# EAGLE design fpga-shield-v1.0 (EAGLE 7.5.0)
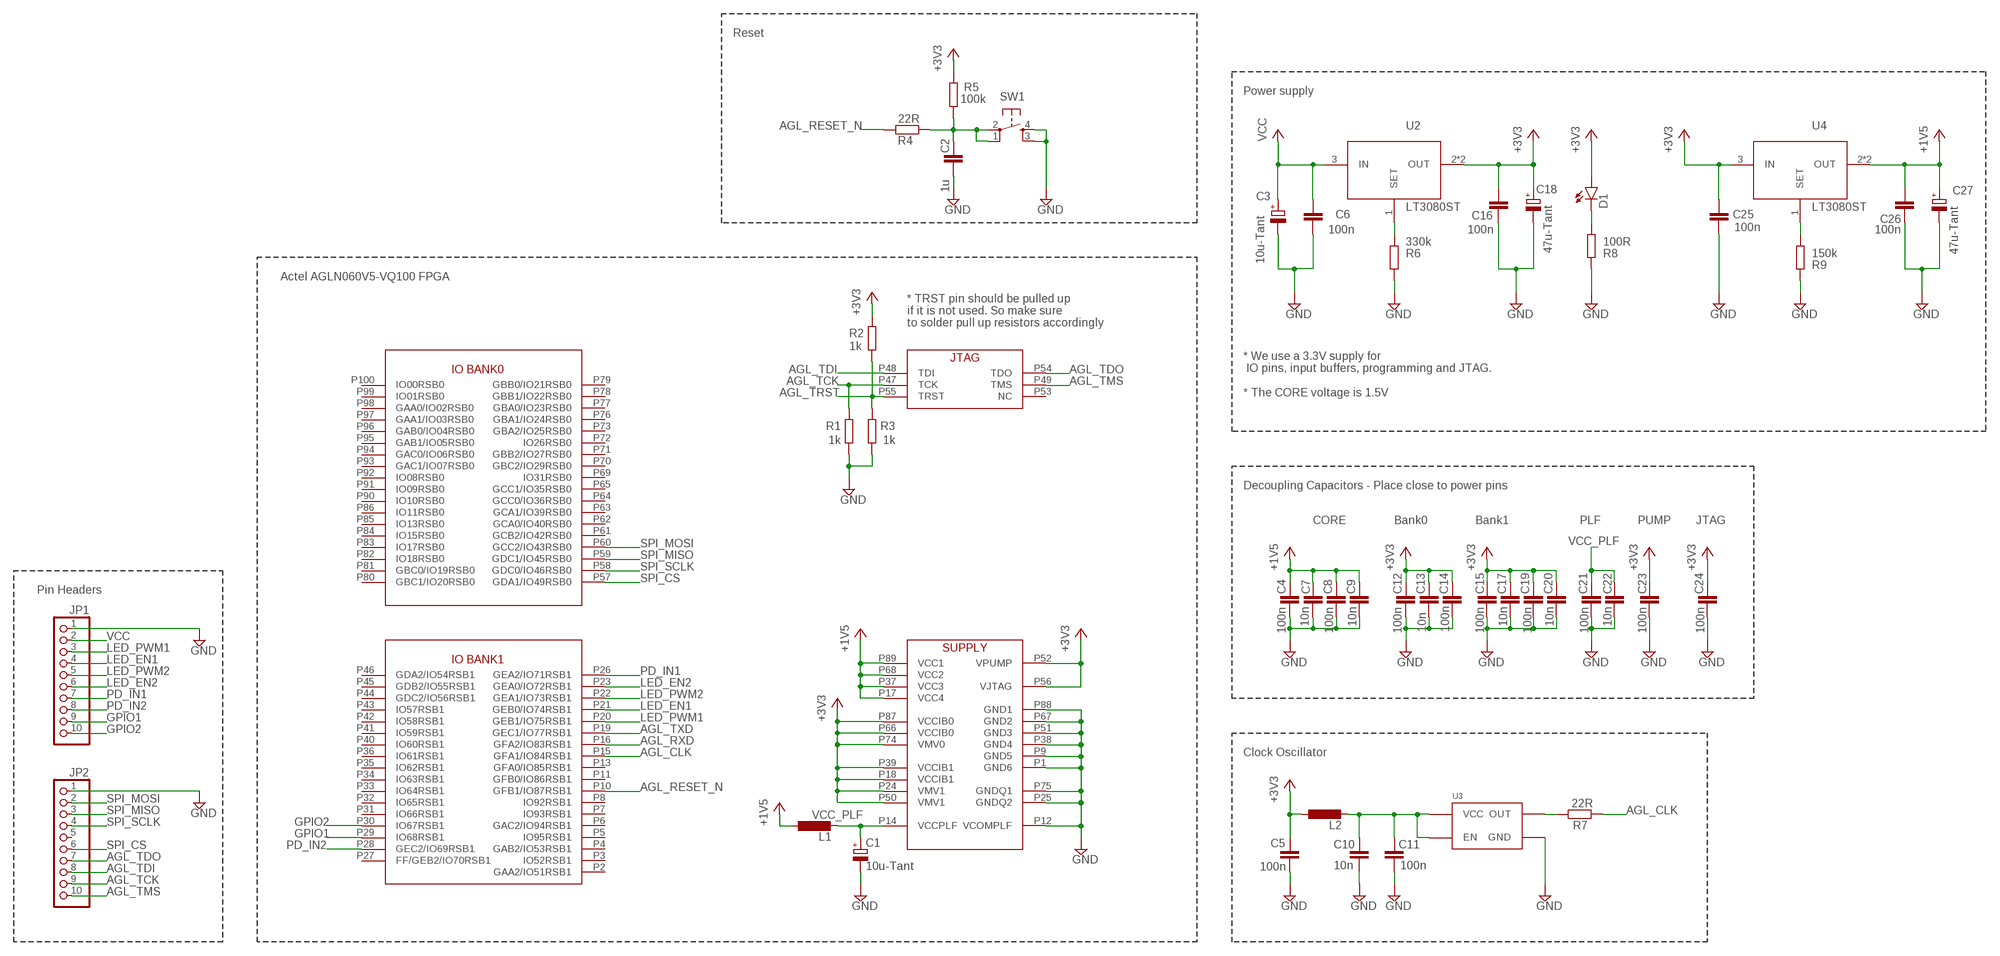
[diagram p0: schematic, sheet 1]

## Parts
C1  10u-Tant  CPOL-EUCT3528  [CT3528]
C2  1u  C-EUC0805  [C0805]
C3  10u-Tant  CPOL-EUCT3528  [CT3528]
C4  100n  C-EUC0805  [C0805]
C5  100n  C-EUC0805  [C0805]
C6  100n  C-EUC0805  [C0805]
C7  10n  C-EUC0805  [C0805]
C8  100n  C-EUC0805  [C0805]
C9  10n  C-EUC0805  [C0805]
C10  10n  C-EUC0805  [C0805]
C11  100n  C-EUC0805  [C0805]
C12  100n  C-EUC0805  [C0805]
C13  10n  C-EUC0805  [C0805]
C14  100n  C-EUC0805  [C0805]
C15  100n  C-EUC0805  [C0805]
C16  100n  C-EUC0805  [C0805]
C17  10n  C-EUC0805  [C0805]
C18  47u-Tant  CPOL-EUCT3528  [CT3528]
C19  100n  C-EUC0805  [C0805]
C20  10n  C-EUC0805  [C0805]
C21  100n  C-EUC0805  [C0805]
C22  10n  C-EUC0805  [C0805]
C23  100n  C-EUC0805  [C0805]
C24  100n  C-EUC0805  [C0805]
C25  100n  C-EUC0805  [C0805]
C26  100n  C-EUC0805  [C0805]
C27  47u-Tant  CPOL-EUCT3528  [CT3528]
D1  LED0603  [LED-0603]
JP1  PINHD-1X10  [1X10]
JP2  PINHD-1X10  [1X10]
L1  L-EUL3216C  [L3216C]
L2  L-EUL3216C  [L3216C]
R1  1k  R-EU_R0805  [R0805]
R2  1k  R-EU_R0805  [R0805]
R3  1k  R-EU_R0805  [R0805]
R4  22R  R-EU_R0805  [R0805]
R5  100k  R-EU_R0805  [R0805]
R6  330k  R-EU_R0805  [R0805]
R7  22R  R-EU_R0805  [R0805]
R8  100R  R-EU_R0805  [R0805]
R9  150k  R-EU_R0805  [R0805]
SW1  10-XX4X4SMD  [BT4X4]
U1  AGLN060VQ100  [VQ100]
U2  LT3080ST  [SOT223]
U3  ASFL1  [ASFL1]
U4  LT3080ST  [SOT223]

## Nets
+1V5: C4.1 C7.1 C8.1 C9.1 C26.1 C27.+ L1.1 U1.P17(VCC4) U1.P37(VCC3) U1.P68(VCC2) U1.P89(VCC1) U4.2(OUT) U4.4(OUT)
+3V3: C5.1 C12.1 C13.1 C14.1 C15.1 C16.1 C17.1 C18.+ C19.1 C20.1 C23.1 C24.1 C25.1 D1.A L2.1 R2.2 R5.2 U1.P18(VCCIB1) U1.P24(VMV1) U1.P39(VCCIB1) U1.P50(VMV1) U1.P52(VPUMP) U1.P56(VJTAG) U1.P66(VCCIB0) U1.P74(VMV0) U1.P87(VCCIB0) U2.2(OUT) U2.4(OUT) U4.3(IN)
AGL_CLK: R7.2 U1.P15(GFA1/IO84RSB1)
AGL_RESET_N: R4.2 U1.P10(GFB1/IO87RSB1)
AGL_RXD: U1.P16(GFA2/IO83RSB1)
AGL_TCK: JP2.9 R1.2 U1.P47(TCK)
AGL_TDI: JP2.8 U1.P48(TDI)
AGL_TDO: JP2.7 U1.P54(TDO)
AGL_TMS: JP2.10 U1.P49(TMS)
AGL_TRST: R2.1 R3.2 U1.P55(TRST)
AGL_TXD: U1.P19(GEC1/IO77RSB1)
GND: C1.- C2.2 C3.- C4.2 C5.2 C6.2 C7.2 C8.2 C9.2 C10.2 C11.2 C12.2 C13.2 C14.2 C15.2 C16.2 C17.2 C18.- C19.2 C20.2 C21.2 C22.2 C23.2 C24.2 C25.2 C26.2 C27.- JP1.1 JP2.1 R1.1 R3.1 R6.2 R8.2 R9.2 SW1.3(S1) SW1.4(S) U1.P1(GND6) U1.P9(GND5) U1.P12(VCOMPLF) U1.P25(GNDQ2) U1.P38(GND4) U1.P51(GND3) U1.P67(GND2) U1.P75(GNDQ1) U1.P88(GND1) U3.P$2(GND)
GPIO1: JP1.9 U1.P29(IO68RSB1)
GPIO2: JP1.10 U1.P30(IO67RSB1)
LED_EN1: JP1.4 U1.P21(GEB0/IO74RSB1)
LED_EN2: JP1.6 U1.P23(GEA0/IO72RSB1)
LED_PWM1: JP1.3 U1.P20(GEB1/IO75RSB1)
LED_PWM2: JP1.5 U1.P22(GEA1/IO73RSB1)
N$1: R7.1 U3.P$3(OUT)
N$2: C10.1 C11.1 L2.2 U3.P$1(EN) U3.P$4(VCC)
N$3: D1.C R8.1
N$4: R6.1 U2.1(SET)
N$6: R9.1 U4.1(SET)
N$7: C2.1 R4.1 R5.1 SW1.1 SW1.2(P)
PD_IN1: JP1.7 U1.P26(GEA2/IO71RSB1)
PD_IN2: JP1.8 U1.P28(GEC2/IO69RSB1)
SPI_CS: JP2.6 U1.P57(GDA1/IO49RSB0)
SPI_MISO: JP2.3 U1.P59(GDC1/IO45RSB0)
SPI_MOSI: JP2.2 U1.P60(GCC2/IO43RSB0)
SPI_SCLK: JP2.4 U1.P58(GDC0/IO46RSB0)
VCC: C3.+ C6.1 JP1.2 U2.3(IN)
VCC_PLF: C1.+ C21.1 C22.1 L1.2 U1.P14(VCCPLF)
Unconnected: JP2.5 U1.P2(GAA2/IO51RSB1) U1.P3(IO52RSB1) U1.P4(GAB2/IO53RSB1) U1.P5(IO95RSB1) U1.P6(GAC2/IO94RSB1) U1.P7(IO93RSB1) U1.P8(IO92RSB1) U1.P11(GFB0/IO86RSB1) U1.P13(GFA0/IO85RSB1) U1.P27(FF/GEB2/IO70RSB1) U1.P31(IO66RSB1) U1.P32(IO65RSB1) U1.P33(IO64RSB1) U1.P34(IO63RSB1) U1.P35(IO62RSB1) U1.P36(IO61RSB1) U1.P40(IO60RSB1) U1.P41(IO59RSB1) U1.P42(IO58RSB1) U1.P43(IO57RSB1) U1.P44(GDC2/IO56RSB1) U1.P45(GDB2/IO55RSB1) U1.P46(GDA2/IO54RSB1) U1.P53(NC) U1.P61(GCB2/IO42RSB0) U1.P62(GCA0/IO40RSB0) U1.P63(GCA1/IO39RSB0) U1.P64(GCC0/IO36RSB0) U1.P65(GCC1/IO35RSB0) U1.P69(IO31RSB0) U1.P70(GBC2/IO29RSB0) U1.P71(GBB2/IO27RSB0) U1.P72(IO26RSB0) U1.P73(GBA2/IO25RSB0) U1.P76(GBA1/IO24RSB0) U1.P77(GBA0/IO23RSB0) U1.P78(GBB1/IO22RSB0) U1.P79(GBB0/IO21RSB0) U1.P80(GBC1/IO20RSB0) U1.P81(GBC0/IO19RSB0) U1.P82(IO18RSB0) U1.P83(IO17RSB0) U1.P84(IO15RSB0) U1.P85(IO13RSB0) U1.P86(IO11RSB0) U1.P90(IO10RSB0) U1.P91(IO09RSB0) U1.P92(IO08RSB0) U1.P93(GAC1/IO07RSB0) U1.P94(GAC0/IO06RSB0) U1.P95(GAB1/IO05RSB0) U1.P96(GAB0/IO04RSB0) U1.P97(GAA1/IO03RSB0) U1.P98(GAA0/IO02RSB0) U1.P99(IO01RSB0) U1.P100(IO00RSB0)

## Notes on the sheet
- Reset
- Power supply
- Actel AGLN060V5-VQ100 FPGA
- * TRST pin should be pulled up
  if it is not used. So make sure 
  to solder pull up resistors accordingly
- * We use a 3.3V supply for 
   IO pins, input buffers, programming and JTAG.
  
  * The CORE voltage is 1.5V
- Decoupling Capacitors - Place close to power pins
- CORE | Bank0 | Bank1 | PLF | PUMP | JTAG
- Pin Headers
- Clock Oscillator

## Library data of the parts
C1 C3 C18 C27 = rcl:CPOL-EU: POLARIZED CAPACITOR, European symbol
C2 C4-C17 C19-C26 = rcl:C-EU: CAPACITOR, European symbol
D1 = misc-parts:LED: LEDs Standard schematic elements and footprints for 5mm, 3mm, 1206, and 0603 sized LEDs. 5mm - Spark Fun Electronics SKU : COM-00529 (and others)
JP1 JP2 = pinhead:PINHD-1X10: PIN HEADER
L1 L2 = resistor:L-EU: INDUCTOR, European symbol
R1-R9 = resistor:R-EU_: RESISTOR, European symbol
SW1 = buttons:10-XX: OMRON SWITCH
U1 = igloo-nano:AGLN060
U2 U4 = misc-parts:LT3080
U3 = misc-parts:ASFL1

## Board
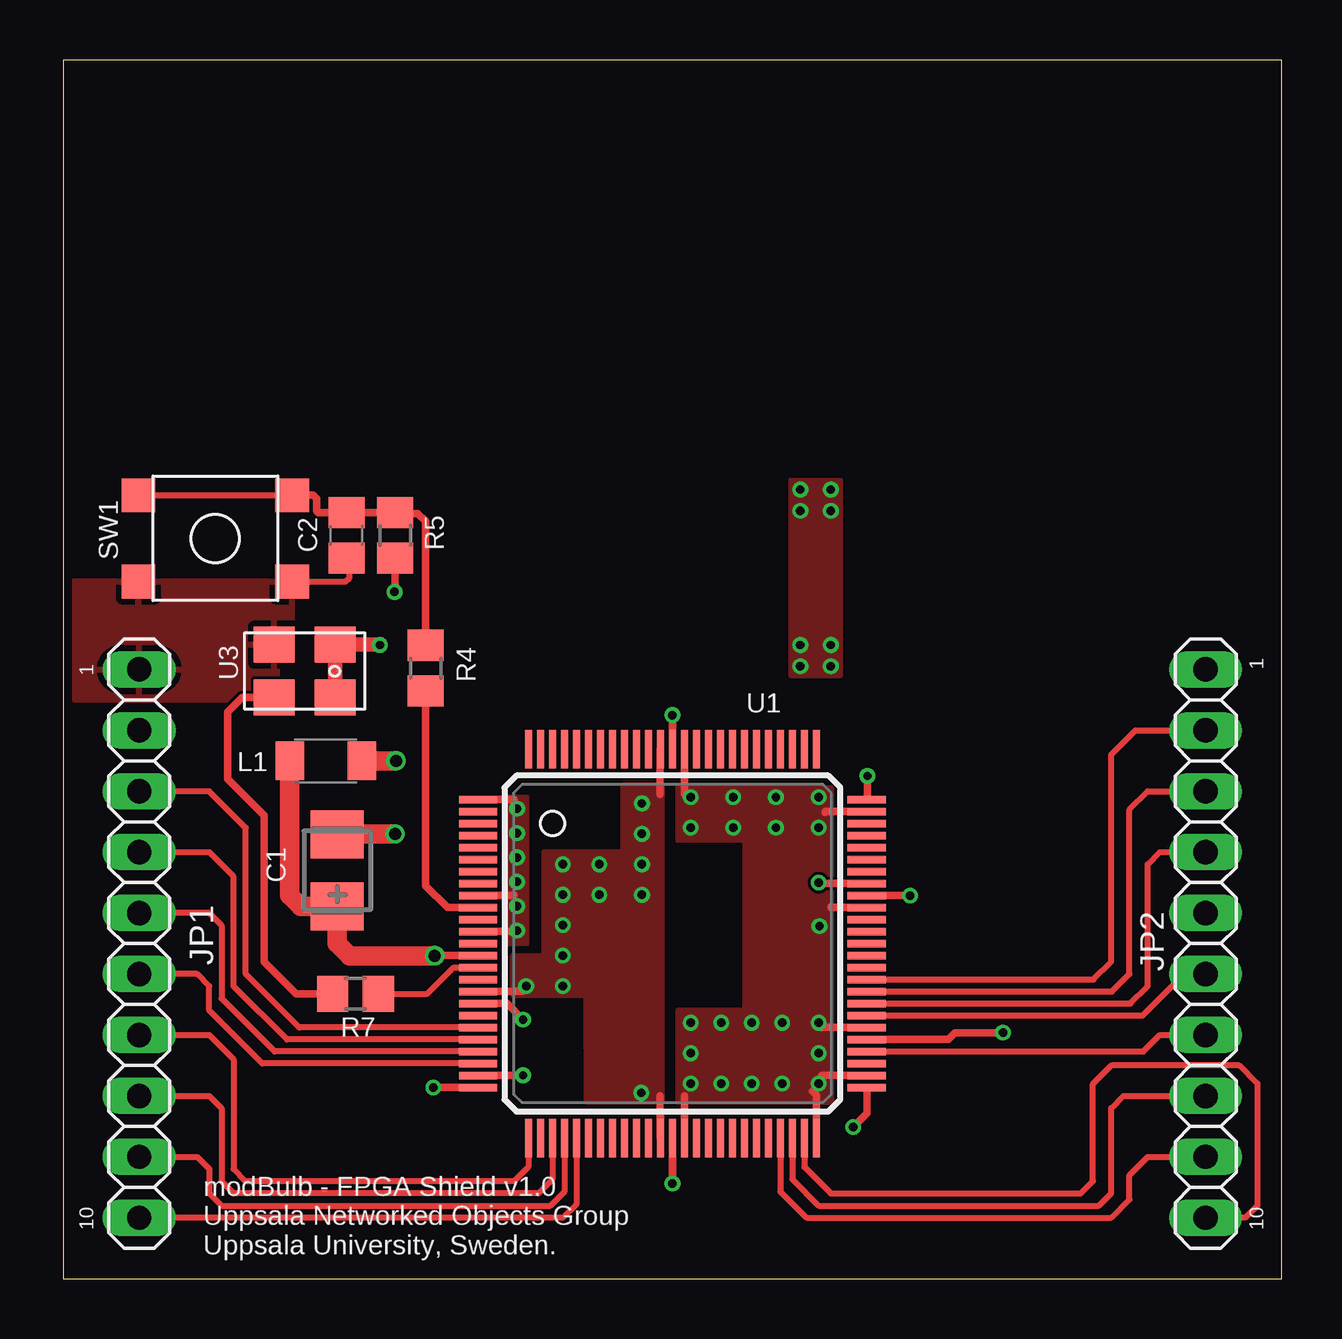
[diagram p1: board, top side]
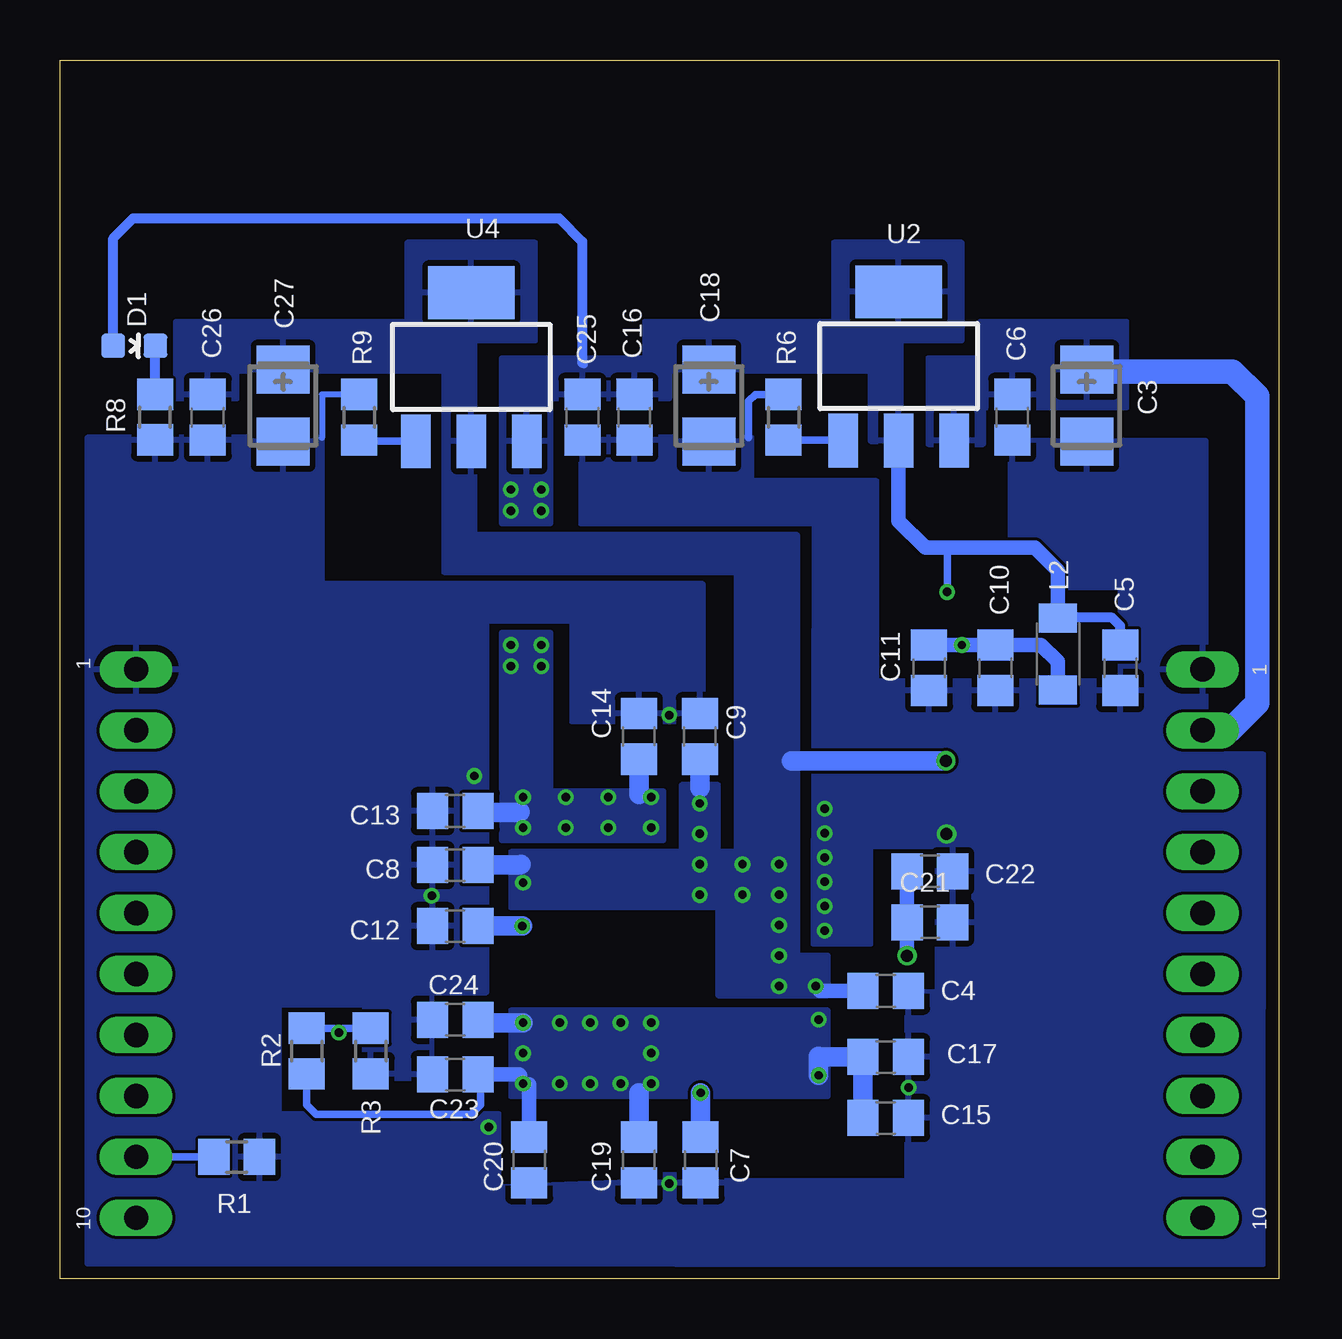
[diagram p2: board, bottom side, seen from below]

Size 50.8 x 50.8 mm. Coordinates in mm from the lower left corner, seen from the top.
Outline: 0,0 50.8,0 50.8,50.8 0,50.8 0,0
Copper layers (1*16): Top 0.035mm / dielectric 1.5mm / Bottom 0.035mm
Design rules "dirt_cheap_dirty_boards.v1": minimum track width 5mil, minimum drill 12mil, track to track 5mil, track to pad 5mil, pad to pad 5mil, via to via 5mil, smd to smd 0mil, copper to edge 10mil, drill to drill 10mil, minimum pad ring 10mil, minimum via ring 6mil, stop-mask expansion 2mil, vias tented up to drill 25mil, thermal gap 10mil

### Footprints (pad centres in the part's own frame; a part is rotated, then mirrored left to right if it is on the bottom)
CT3528 = smd 2 x 2.2: + -1.5,0; - 1.5,0
C0805 = smd 1.3 x 1.5: 1 -0.95,0; 2 0.95,0
LED-0603 = smd 1 x 1: A 0,-0.877; C 0,0.877
1X10 = drill 1.016 long: 1 -11.43,0; 2 -8.89,0; 3 -6.35,0; 4 -3.81,0; 5 -1.27,0; 6 1.27,0; 7 3.81,0; 8 6.35,0; 9 8.89,0; 10 11.43,0
L3216C = smd 1.2 x 1.6: 1 -1.5,0; 2 1.5,0
R0805 = smd 1.3 x 1.5: 1 -0.95,0; 2 0.95,0
BT4X4 = smd 1.4 x 1.4: 1 -1.8,3.2; 2 -1.8,-3.2; 3 1.8,3.2; 4 1.8,-3.2
VQ100 = smd 1.6 x 0.3: P1 -8.1,6; P2 -8.1,5.5; P3 -8.1,5; P4 -8.1,4.5; P5 -8.1,4; P6 -8.1,3.5; P7 -8.1,3; P8 -8.1,2.5; P9 -8.1,2; P10 -8.1,1.5; P11 -8.1,1; P12 -8.1,0.5; P13 -8.1,0; P14 -8.1,-0.5; P15 -8.1,-1; P16 -8.1,-1.5; P17 -8.1,-2; P18 -8.1,-2.5; P19 -8.1,-3; P20 -8.1,-3.5; P21 -8.1,-4; P22 -8.1,-4.5; P23 -8.1,-5; P24 -8.1,-5.5; P25 -8.1,-6; P51 8.1,-6; P52 8.1,-5.5; P53 8.1,-5; P54 8.1,-4.5; P55 8.1,-4; P56 8.1,-3.5; P57 8.1,-3; P58 8.1,-2.5; P59 8.1,-2; P60 8.1,-1.5; P61 8.1,-1; P62 8.1,-0.5; P63 8.1,0; P64 8.1,0.5; P65 8.1,1; P66 8.1,1.5; P67 8.1,2; P68 8.1,2.5; P69 8.1,3; P70 8.1,3.5; P71 8.1,4; P72 8.1,4.5; P73 8.1,5; P74 8.1,5.5; P75 8.1,6 | smd 0.3 x 1.6: P26 -6,-8.1; P27 -5.5,-8.1; P28 -5,-8.1; P29 -4.5,-8.1; P30 -4,-8.1; P31 -3.5,-8.1; P32 -3,-8.1; P33 -2.5,-8.1; P34 -2,-8.1; P35 -1.5,-8.1; P36 -1,-8.1; P37 -0.5,-8.1; P38 0,-8.1; P39 0.5,-8.1; P40 1,-8.1; P41 1.5,-8.1; P42 2,-8.1; P43 2.5,-8.1; P44 3,-8.1; P45 3.5,-8.1; P46 4,-8.1; P47 4.5,-8.1; P48 5,-8.1; P49 5.5,-8.1; P50 6,-8.1; P76 6,8.1; P77 5.5,8.1; P78 5,8.1; P79 4.5,8.1; P80 4,8.1; P81 3.5,8.1; P82 3,8.1; P83 2.5,8.1; P84 2,8.1; P85 1.5,8.1; P86 1,8.1; P87 0.5,8.1; P88 0,8.1; P89 -0.5,8.1; P90 -1,8.1; P91 -1.5,8.1; P92 -2,8.1; P93 -2.5,8.1; P94 -3,8.1; P95 -3.5,8.1; P96 -4,8.1; P97 -4.5,8.1; P98 -5,8.1; P99 -5.5,8.1; P100 -6,8.1
SOT223 = smd 1.219 x 2.235: 1 -2.311,-3.099; 2 0,-3.099; 3 2.311,-3.099 | smd 3.6 x 2.2: 4 0,3.099
ASFL1 = smd 1.7 x 1.5: P$1 0.85,0.75; P$2 3.39,0.75; P$3 3.39,2.95; P$4 0.85,2.95

### Placement (x,y rotation side)
C1  11.43,17.02 90 top
C2  11.81,30.99 270 top
C3  8,36.39 270 bottom
C4  16.38,12 0 bottom
C5  6.6,25.46 270 bottom
C6  11.11,35.91 270 bottom
C7  24.1,4.95 270 bottom
C8  34.32,17.24 180 bottom
C9  24.13,22.61 90 bottom
C10  11.81,25.46 270 bottom
C11  14.57,25.46 270 bottom
C12  34.32,14.7 180 bottom
C13  34.32,19.49 180 bottom
C14  26.67,22.61 90 bottom
C15  16.38,6.7 0 bottom
C16  26.86,35.91 270 bottom
C17  16.38,9.24 0 bottom
C18  23.75,36.39 270 bottom
C19  26.67,4.95 270 bottom
C20  31.24,4.95 270 bottom
C21  14.54,14.86 0 bottom
C22  14.54,16.99 0 bottom
C23  34.32,8.51 180 bottom
C24  34.32,10.79 180 bottom
C25  29.02,35.91 270 bottom
C26  44.64,35.91 270 bottom
C27  41.5,36.39 270 bottom
D1  47.7,38.89 270 bottom
JP1  3.17,13.97 270 top
JP2  47.62,13.97 270 top
L1  10.95,21.59 180 top
L2  9.21,26.04 270 bottom
R1  43.43,5.08 180 bottom
R2  40.51,9.49 270 bottom
R3  37.85,9.49 90 bottom
R4  15.11,25.45 270 top
R5  13.84,30.99 270 top
R6  20.64,35.91 90 bottom
R7  12.19,11.87 0 top
R8  46.84,35.92 270 bottom
R9  38.32,35.91 90 bottom
SW1  6.35,30.86 270 top
U1  25.4,13.97 0 top
U2  15.84,38.04 0 bottom
U3  12.19,27.18 180 top
U4  33.66,38 0 bottom

### Tracks (layer width: path | path; a pad name or v marks a point on that pad's centre or on a via)
+1V5  (via drill 0.35, 0.5)
  Top 0.254: U1.P89
  Top 0.305: U1.P37 | U1.P17 19.14,11.97 | U1.P89 24.89,20.19 | U1.P68 | U1.P37 24.9,6.95 | U1.P68 32.39,16.47 | U1.P37 24.89,7.62 | U1.P68 31.54,16.47 v31.5,16.51
  Top 0.813: v13.88,21.59 L1.1
  Bottom 0.61: C4.1 19.11,12
  Bottom 0.813: 31.59,17.27 31.62,17.24 C8.1 | C9.1 24.13,20.45 | C7.1 v24.1,7.75 | v13.88,21.59 20.32,21.59
  other vias: 19.3,12.19 20.83,17.27 22.35,17.27 24.13,17.27 20.83,12.19 20.83,13.46 20.83,14.73 22.35,16 24.13,16 20.83,16 24.13,19.81 24.13,18.54
  pour Bottom (rank 2): 30.99,43.18 36.32,43.18 36.32,39.88 45.97,39.88 45.97,36.7 43.43,36.7 43.43,37.85 34.8,37.85 34.8,34.92 33.53,34.92 33.53,39.12 30.99,39.12
  pour Bottom (rank 2): 20.07,17.78 23.37,17.78 23.37,20.57 24.89,20.57 24.89,17.78 32,17.78 32,15.49 23.37,15.49 23.37,11.81 18.8,11.81 18.8,13.46 20.07,13.46
  pour Top: 20.07,17.78 23.37,17.78 23.37,20.57 24.96,20.57 24.96,7.37 21.84,7.37 21.81,11.81 18.76,11.81 18.76,13.46 20.07,13.46
  pour Bottom (rank 2): 20.07,30.99 33.53,30.99 33.53,35.05 34.8,35.05 34.8,29.46 22.61,29.46 22.61,17.02 20.07,17.02
+3V3  (via drill 0.35)
  Top 0.305: U1.P39 25.91,7.62 | U1.P52 31.63,8.47 31.62,8.48 | U1.P24 v19.18,8.48 | U1.P18 18.5,11.47 v19.18,10.79 | U1.P56 31.62,10.47 | U1.P66 32,15.47 32,15.49 | U1.P50 31.4,7.65 31.24,7.81 | U1.P87 25.9,20.2 25.91,20.19 | U1.P74 31.79,19.47 31.75,19.43 | R5.2 13.84,28.65 v13.82,28.63
  Bottom 0.305: 33.31,19.43 C13.1 | C23.1 33.27,8.41 33.27,7.24 33.66,6.86 40.13,6.86 40.51,7.24 R2.2 | v13.82,28.63 13.82,30.38 13.72,30.48 | 29.03,38.18 28.96,38.1
  Bottom 0.406: C5.1 6.6,27.21 6.95,27.56 9.18,27.56 L2.1 | D1.A 48.58,43.37 47.75,44.2 30,44.2 29.03,43.23 29.03,38.18
  Bottom 0.61: C23.1 31.66,8.51 31.62,8.48 | C20.1 31.24,8.1 | L2.1 9.21,29.53 10.16,30.48 13.72,30.48 14.73,30.48 15.84,31.59 U2.2
  Bottom 0.813: C14.1 26.67,20.19 | 33.31,19.43 31.66,19.43 31.62,19.46 | C12.1 v31.53,14.7 | v19.18,8.48 19.18,9.27 19.14,9.24 C17.1 C15.1 | C19.1 26.67,7.75 | C24.1 33.37,10.67 v31.5,10.67
  other vias: 26.16,10.67 26.16,8.13 31.5,8.13 27.43,10.67 29.97,10.67 28.7,10.67 26.16,9.4 27.43,8.13 28.7,8.13 29.97,8.13 31.5,9.4 26.16,20.07 26.16,18.8 31.5,20.07 31.5,18.8 27.94,20.07 29.72,20.07 27.94,18.8 29.72,18.8 30.73,26.42 32,26.42 30.73,25.53 32,25.53 30.73,32.89 32,32.89 32,32 30.73,32
  pour Bottom: 13.21,43.18 18.54,43.18 18.54,39.88 26.42,39.88 26.42,38.35 32.38,38.35 32.38,34.92 30.35,34.92 30.35,36.7 25.4,36.7 25.4,37.85 17.02,37.85 17.02,34.92 15.75,34.92 15.75,39.12 13.21,39.12
  pour Bottom (rank 2): 25.65,20.32 30.35,20.32 30.35,26.92 32.38,26.92 32.38,18.29 25.65,18.29
  pour Bottom: 18.8,11.18 32,11.18 32,7.62 18.8,7.62
  pour Top: 25.65,20.45 32,20.45 32,7.37 25.65,7.37 25.65,11.18 28.45,11.18 28.45,18.29 25.65,18.29
  pour Top (rank 2): 30.35,33.27 32.38,33.27 32.38,25.15 30.35,25.15
  pour Bottom (rank 2): 30.35,35.05 32.38,35.05 32.38,31.5 30.35,31.5
AGL_CLK
  Top 0.254: R7.2 15.18,11.87 16.26,12.95 17.28,12.95 U1.P15
AGL_RESET_N
  Top 0.305: U1.P10 16.03,15.47 15.11,16.38 R4.2
AGL_TCK
  Top 0.254: U1.P47 29.9,3.63 30.99,2.54 43.69,2.54 44.45,3.3 44.45,4.32 45.21,5.08 JP2.9
  Bottom 0.305: R1.2 JP2.9
AGL_TDI
  Top 0.254: JP2.8 44.2,7.62 43.69,7.11 43.69,3.56 43.18,3.05 31.5,3.05 30.4,4.14 U1.P48
AGL_TDO
  Top 0.254: U1.P54 45.03,9.47 45.72,10.16 JP2.7
AGL_TMS
  Top 0.254: U1.P49 30.9,4.66 32,3.56 42.42,3.56 42.93,4.06 42.93,8.13 43.69,8.89 49.02,8.89 49.78,8.13 49.78,3.05 49.28,2.54 JP2.10
AGL_TRST  (via drill 0.35)
  Top 0.305: U1.P55 36.89,9.97 37.18,10.26 v39.18,10.26
  Bottom 0.305: R2.1 39.37,10.44 v39.18,10.26 38.99,10.44 R3.2
GND  (via drill 0.35, 0.5)
  Top 0.254: SW1.3 11.79,29.06 11.94,29.21 11.94,29.91 C2.2
  Top 0.305: U1.P88 v25.4,23.5 | U1.P67 | U1.P67 v35.31,15.97 | U1.P38 v25.4,3.97 | U1.P25 v15.43,7.97 | U1.P1 18.8,19.97 18.8,19.81 | U1.P9 18.8,15.97 18.8,16 | U1.P12 18.8,14.47 18.8,14.48 | U1.P75 33.53,19.97 v33.53,20.95 | U1.P51 33.5,6.89 v32.93,6.32
  Top 0.813: v13.84,18.54 11.45,18.54 C1.-
  Bottom 0.254: R9.2 39.88,36.86 39.88,35.05
  Bottom 0.305: R6.2 21.82,36.86 22.1,36.58 22.1,35.05
  Bottom 0.61: 35.31,8.47 C23.2
  other vias: 18.92,19.59 18.92,18.57 18.92,17.56 18.92,16.54 18.92,15.53 18.92,14.51
  pour Bottom: 0.66,0.61 0.64,21.84 3.05,21.84 3.05,24.89 16.76,24.89 16.76,33.24 21.97,33.24 21.97,35.05 29.08,35.05 29.08,31.5 19.35,31.5 19.4,13.97 17.02,13.97 17.02,18.03 14.22,18.03 14.22,11.94 15.49,11.94 15.49,4.06 24.89,4.06 24.89,4.32 25.91,4.32 25.91,4.06 32.51,3.81 32.51,6.86 41.66,6.86 41.66,11.43 38.1,11.43 38.1,8.38 35.31,8.38 35.31,11.94 33.02,11.94 33.02,27.43 29.46,27.43 29.46,23.24 24,23.24 24,28.96 39.88,28.96 39.88,35.05 49.66,35.05 49.66,0.64
  pour Top: 18.54,20.07 19.3,20.07 19.3,13.97 18.54,13.97
  pour Bottom (rank 2): 3.05,34.92 11.18,34.92 11.18,28.83 6.6,28.83 6.6,24.13 3.05,24.13
  pour Top (rank 2): 0.51,29.08 9.53,29.08 9.53,26.67 8.89,26.67 8.92,24.13 0.51,24.13
GPIO1
  Top 0.254: U1.P29 20.9,3.63 20.32,3.05 6.6,3.05 6.1,3.56 6.1,4.57 5.59,5.08 JP1.9
GPIO2
  Top 0.254: U1.P30 21.4,3.11 20.83,2.54 JP1.10
LED_EN1
  Top 0.254: U1.P21 9.33,9.97 7.11,12.19 7.11,16.76 6.1,17.78 JP1.4
LED_EN2
  Top 0.254: U1.P23 8.3,8.97 6.1,11.18 6.1,12.19 5.59,12.7 JP1.6
LED_PWM1
  Top 0.254: U1.P20 9.85,10.47 7.62,12.7 7.62,18.8 6.1,20.32 JP1.3
LED_PWM2
  Top 0.254: U1.P22 8.82,9.47 6.6,11.68 6.6,14.73 6.1,15.24 JP1.5
N$1
  Top 0.305: U3.P$3 7.46,24.23 6.86,23.62 6.86,20.83 8.38,19.3 8.38,13.21 9.72,11.87 R7.1
N$2  (via drill 0.35)
  Top 0.61: v13.21,26.42 v13.21,26.43 U3.P$1 U3.P$4
  Bottom 0.61: L2.2 9.21,25.72 9.91,26.42 C10.1 v13.21,26.42 v13.21,26.41 C11.1
N$3
  Bottom 0.305: R8.1 46.82,36.87
  Bottom 0.406: 46.82,36.87 D1.C
N$4
  Bottom 0.305: R6.1 18.18,34.96 U2.1
N$6
  Bottom 0.305: U4.1 38.32,34.91 R9.1
N$7
  Top 0.254: 13.9,31.88 R5.1 | SW1.2 SW1.1
  Top 0.305: R4.1 15.11,31.57 14.78,31.9 13.88,31.9 R5.1 C2.1 10.63,31.94 10.57,32 10.57,32.51 10.42,32.66 SW1.1
PD_IN1
  Top 0.254: U1.P26 19.4,4.67 18.8,4.06 7.62,4.06 7.11,4.57 7.11,9.14 6.1,10.16 JP1.7
PD_IN2
  Top 0.254: U1.P28 20.4,4.14 19.81,3.56 7.11,3.56 6.6,4.06 6.6,7.11 6.1,7.62 JP1.8
SPI_CS
  Top 0.254: U1.P57 45.01,10.97 46.74,12.7 JP2.6
SPI_MISO
  Top 0.254: U1.P59 43.72,11.97 44.45,12.7 44.45,19.56 45.21,20.32 JP2.3
SPI_MOSI
  Top 0.254: U1.P60 42.95,12.47 43.69,13.21 43.69,21.84 44.7,22.86 JP2.2
SPI_SCLK
  Top 0.254: U1.P58 44.49,11.47 45.21,12.19 45.21,17.27 45.72,17.78 JP2.4
VCC
  Bottom 1.016: JP1.2 2.03,22.86 0.89,24 0.89,36.78 1.93,37.82 7.94,37.82 C3.+ 7.99,37.87
  pour Bottom (rank 3): 6.35,39.88 12.45,39.88 12.45,38.35 14.61,38.35 14.61,34.8 12.32,34.8 12.32,36.32 6.35,36.32
VCC_PLF  (via drill 0.5)
  Top 0.305: U1.P14 15.5,13.47 v15.49,13.46
  Top 0.813: 11.41,15.49 C1.+ | L1.2 9.45,15.98 9.91,15.53 C1.+ | C1.+ 11.43,13.97 11.94,13.46 v15.49,13.46
  Bottom 0.61: C22.1 C21.1 v15.49,13.46

### Text on the board
tNames: 1 | 1 | 10 | 10 | modBulb - FPGA Shield v1.0 / Uppsala Networked Objects Group / Uppsala University, Sweden.
bNames: 1 | 1 | 10 | 10